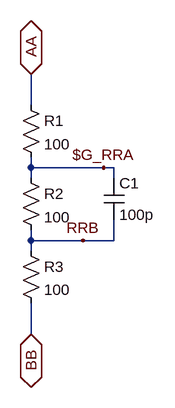
[diagram p0: schematic R3R__A.asc]
R3R__A.asc, the LTspice schematic file:
Version 4
SHEET 1 880 680
WIRE 80 144 80 96
WIRE 80 240 80 224
WIRE 192 240 80 240
WIRE 208 240 192 240
WIRE 80 256 80 240
WIRE 208 256 208 240
WIRE 80 352 80 336
WIRE 160 352 80 352
WIRE 208 352 208 320
WIRE 208 352 160 352
WIRE 80 368 80 352
WIRE 80 496 80 448
FLAG 192 240 $G_RRA
FLAG 160 352 RRB
FLAG 80 96 AA
IOPIN 80 96 BiDir
FLAG 80 496 BB
IOPIN 80 496 BiDir
SYMBOL res 64 128 R0
SYMATTR InstName R1
SYMATTR Value 100
SYMBOL res 64 240 R0
SYMATTR InstName R2
SYMATTR Value 100
SYMBOL res 64 352 R0
SYMATTR InstName R3
SYMATTR Value 100
SYMBOL cap 192 256 R0
SYMATTR InstName C1
SYMATTR Value 100p

The netlist it stands for:
* R3R__A.asc
R1 AA $G_RRA 100
R2 $G_RRA RRB 100
R3 RRB BB 100
C1 $G_RRA RRB 100p
.backanno
.end